# Altium schematic sheet Sheet3_CP2102.SchDoc: CP2102 USB-UART Interface
size A4; DrawnBy: D.N.Nhuan; Revision: NT-1.1; SheetNumber: 3; SheetTotal: 5
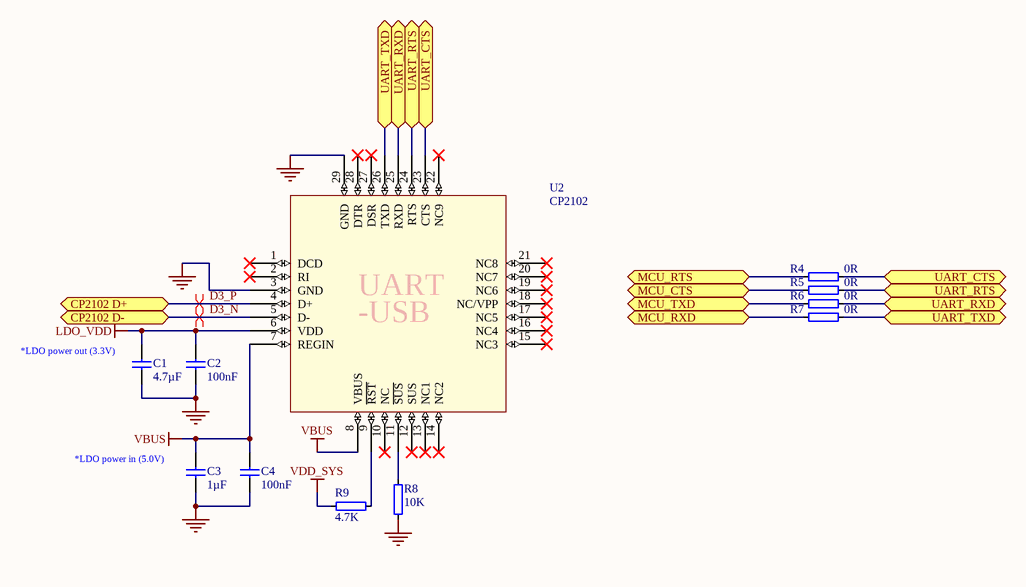
[diagram p0: Sheet3_CP2102.SchDoc]

## Parts
C1  4.7µF  [0603_Imperial]
C2  100nF  [0402 imperial]
C3  1µF  [0603_Imperial]
C4  100nF  [0402 imperial]
R4  0R  [0402 imperial]
R5  0R  [0402 imperial]
R6  0R  [0402 imperial]
R7  0R  [0402 imperial]
R8  10K  [0402 imperial]
R9  4.7K  [0402 imperial]
U2  CP2102  [QFN28-CP2102]

## Ports
CP2102 D+, CP2102 D-, MCU_CTS, MCU_RTS, MCU_RXD, MCU_TXD, UART_CTS, UART_RTS, UART_RXD, UART_TXD

## Nets
GND: C1.1 C2.1 C3.1 C4.1 R8.2 U2.3(GND) U2.29(GND)
LDO_VDD: C1.2 C2.2 U2.6(VDD)
VBUS: C3.2 C4.2 U2.7(REGIN) U2.8(VBUS)
VDD_SYS: R9.2
D3_N: U2.5(D-) ; port CP2102 D-
D3_P: U2.4(D+) ; port CP2102 D+
MCU_CTS: R5.1 ; port MCU_CTS
MCU_RTS: R4.1 ; port MCU_RTS
MCU_RXD: R7.1 ; port MCU_RXD
MCU_TXD: R6.1 ; port MCU_TXD
UART_CTS: R4.2 U2.23(CTS) ; port UART_CTS
UART_RTS: R5.2 U2.24(RTS) ; port UART_RTS
UART_RXD: R6.2 U2.25(RXD) ; port UART_RXD
UART_TXD: R7.2 U2.26(TXD) ; port UART_TXD
NetR8_1: R8.1 U2.11(~{SUS})
NetR9_1: R9.1 U2.9(~{RST})

Not connected (* = marked no-connect by the designer): U2 1(DCD)* 2(RI)* 10(NC)* 12(SUS)* 13(NC1)* 14(NC2)* 15(NC3)* 16(NC4)* 17(NC5)* 18(NC/VPP)* 19(NC6)* 20(NC7)* 21(NC8)* 22(NC9)* 27(DSR)* 28(DTR)*

## Layout directives
differential pair: D3_N, D3_P

## Notes on the sheet
- (near C1) *LDO power out (3.3V)
- (near C3) *LDO power in (5.0V)
- Title
- Sheet
- of
- Size:
- A4
- Revision:
- Drawn by:
- Date:
- Time:
- (in symbol CP2102) UART; -USB

## Library data of the parts
C1-C4 = Capacitor: Genaral Schematic; Tolerance: ±5%; Suppiler: *; Link of Supplier: *; Manufacturer: *; Manufacturer Part Number: *; Footprint: 0402
  C1: Value: 4.7µF
  C2 C4: Value: 100nF
  C3: Value: 1µF
R4-R9 = Resistor: General Schematic; Tolerance: ±5%; Supplier: *; Link of Supplier: *; Footprint: 0402
  R4-R7: Value: 0R
  R8: Value: 10K
  R9: Value: 4.7K
U2 = CP2102: Silicon Labs